# Altium schematic sheet AVCF-Schematics.SchDoc
size B; SheetNumber: 1; SheetTotal: 1
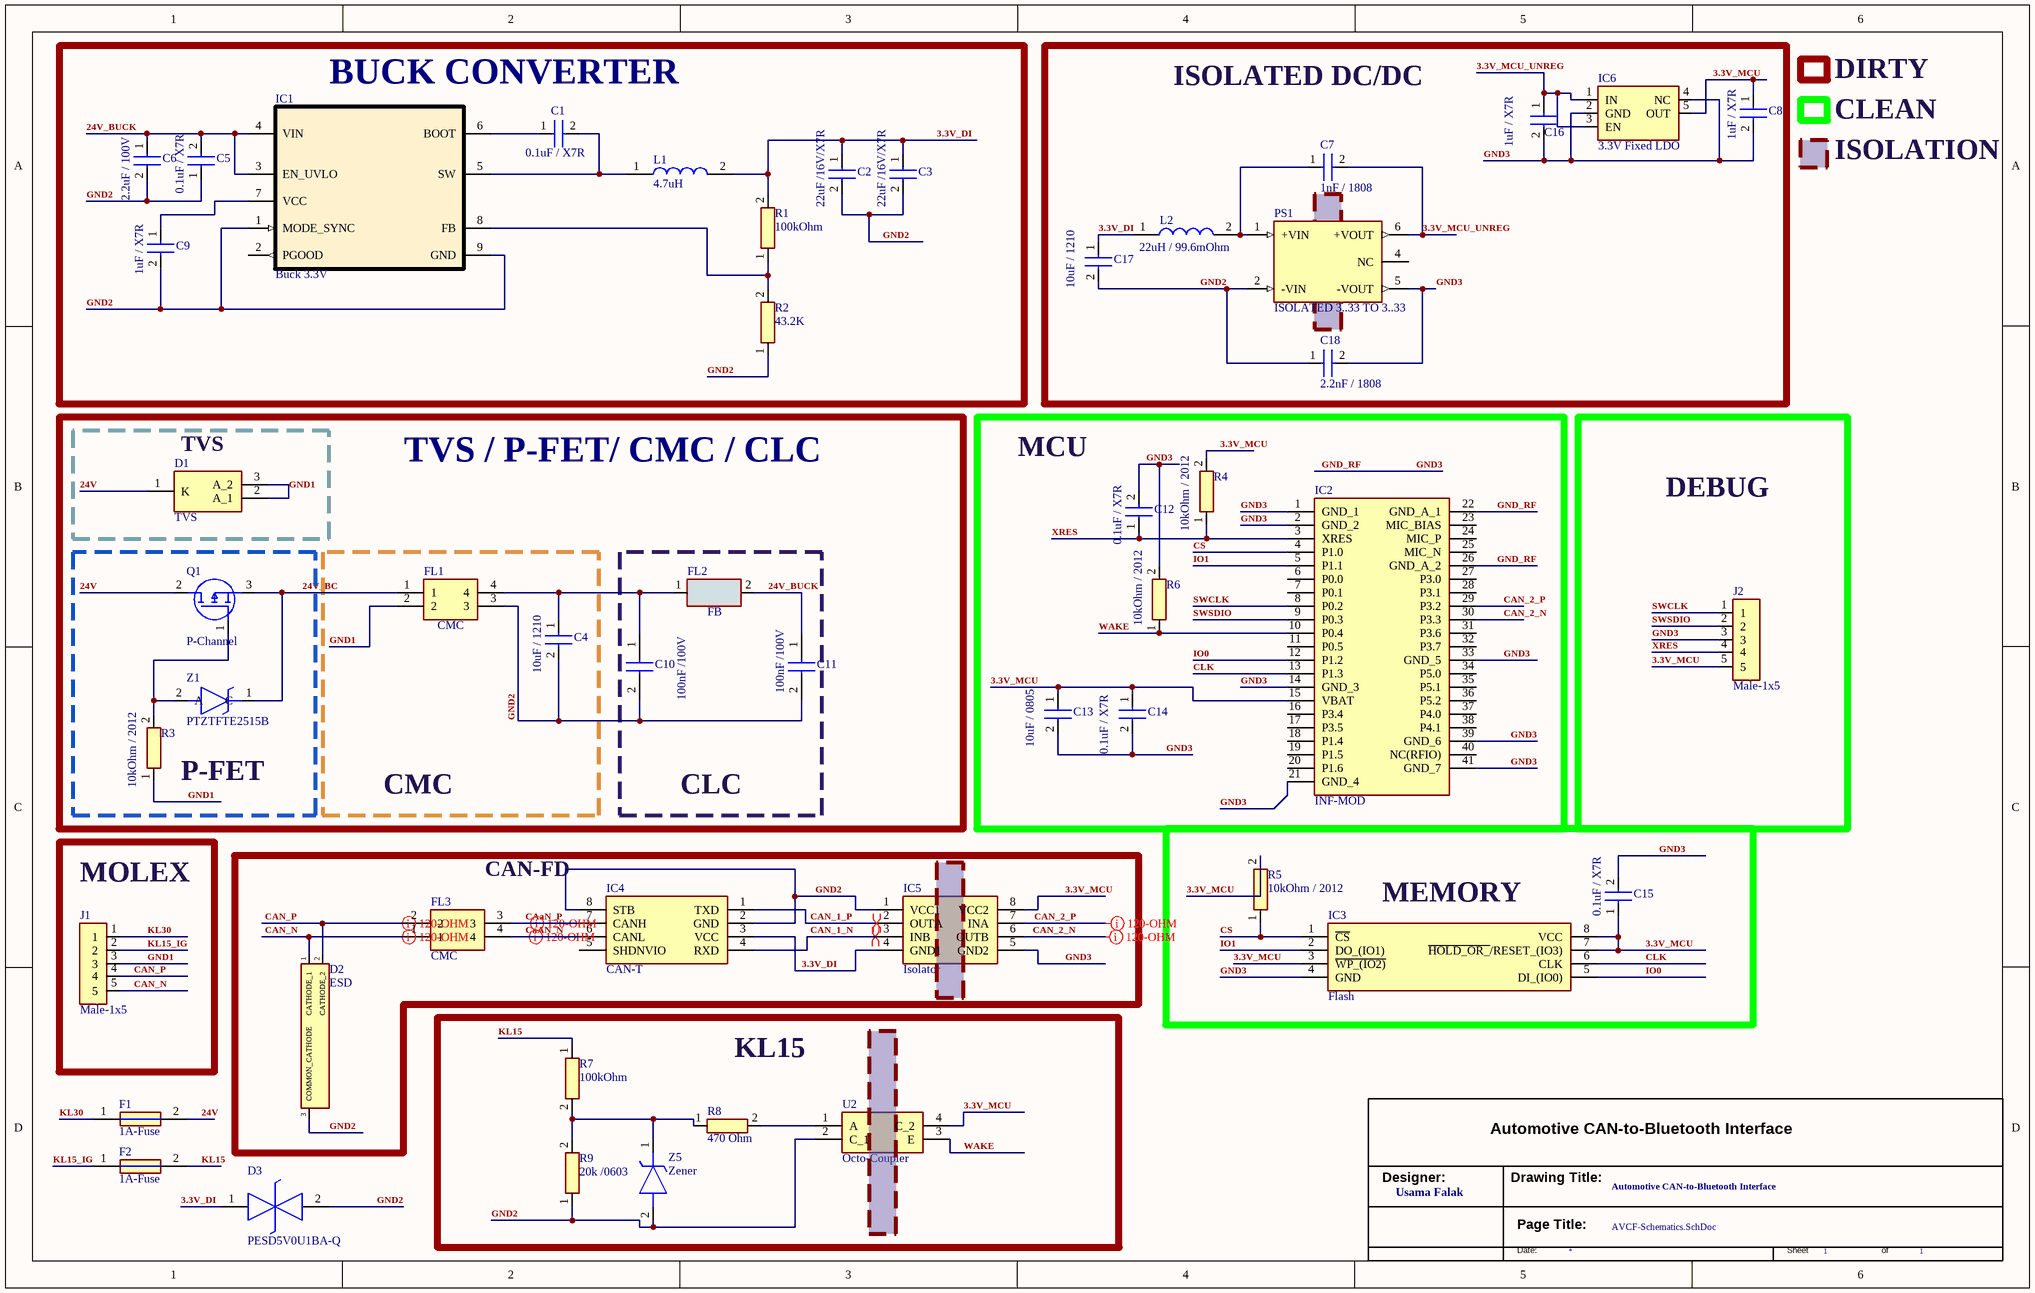
[diagram p0: AVCF-Schematics.SchDoc]

## Parts
*  TitleBlock_MCPG  (value not drawn)  (graphical)
C1  0.1uF / X7R  [MAJx16]
C2  22uF /16V/X7R  [CAPC3225X280N]
C3  22uF /16V/X7R  [CAPC3225X280N]
C4  10uF / 1210  [CAPC3225X280N]
C5  0.1uF / X7R  [MAJx16]
C6  2.2uF / 100V  [CGA4J2NP01H223J125AA]
C7  1nF / 1808  [C1808]
C8  1uF / X7R  [CAPC1608X100N]
C9  1uF / X7R  [CAPC1608X100N]
C10  100nF /100V  [CAPC1608X87N]
C11  100nF /100V  [CAPC1608X87N]
C12  0.1uF / X7R  [MAJx16]
C13  10uF / 0805  [CGA4J2NP01H223J125AA]
C14  0.1uF / X7R  [MAJx16]
C15  0.1uF / X7R  [MAJx16]
C16  1uF / X7R  [CAPC1608X100N]
C17  10uF / 1210  [CAPC3225X280N]
C18  2.2nF / 1808  [C1808]
D1  TVS  [SLD8S36A]
D2  ESD  [SOT95P230X110-3N]
D3  PESD5V0U1BA‑Q  [PESD5V0U1BA115]
F1  1A-Fuse  [FUSC6127X294N]
F2  1A-Fuse  [FUSC6127X294N]
FL1  CMC  [ACT45B1012PTL003]
FL2  FB  [BLM31KN102BH1L]
FL3  CMC  [ACT45B1012PTL003]
IC1  Buck 3.3V  [RPE0009A]
IC2  INF-MOD  [CYW20829B0P4TAI100XUMA1]
IC3  Flash  [SOIC127P790X216-8N]
IC4  CAN-T  [SOIC127P600X175-8N]
IC5  Isolator  [SOIC127P600X175-8N]
IC6  3.3V Fixed LDO  [SOT95P280X145-5N]
J1  Male-1x5  [43650-05(12,13,14)]
J2  Male-1x5  [43650-05(12,13,14)]
L1  4.7uH  [MSS6132T472MLC]
L2  22uH / 99.6mOhm  [XAL5030]
PS1  ISOLATED 3..33 TO 3..33  [CONV_RB-3.33.3S]
Q1  P-Channel  [FQD20N06TM]
R1  100kOhm  [RCS0805_E3]
R2  43.2K  [ERJP03_PA3_(0603)]
R3  10kOhm / 2012  [RESC2012X60N]
R4  10kOhm / 2012  [RESC2012X60N]
R5  10kOhm / 2012  [RESC2012X60N]
R6  10kOhm / 2012  [RESC2012X60N]
R7  100kOhm  [RCS0805_E3]
R8  470 Ohm  [RESC2012X50N]
R9  20k /0603  [RESC1608X55N]
U2  Octo-Coupler  [SOP254P695X242-4N]
Z1  PTZTFTE2515B  [PTZTFTE2515B]
Z5  Zener  [SOD3716X145N]

## Blocks framed on the sheet
BUCK CONVERTER: C1-C3 C5 C6 C9 IC1 L1 R1 R2
ISOLATED DC/DC: C7 C8 C16-C18 IC6 L2 PS1
TVS: D1
MCU: C12-C14 IC2 R4 R6
DEBUG: J2
P-FET: Q1 R3 Z1
CMC: C4 FL1
CLC: C10 C11 FL2
MOLEX: J1
CAN-FD: D2 FL3 IC4 IC5
MEMORY: C15 IC3 R5
KL15: R7-R9 U2 Z5

## Nets
3.3V_DI: C2.1 C3.1 C17.1 D3.1(K1) IC4.3(VCC) IC5.4(GND1) L1.2 L2.1 R1.2
3.3V_MCU: C8.1 C13.1 C14.1 C15.1 IC2.15(VBAT) IC3.3(~{WP_(IO2)}) IC3.7(~{HOLD_OR_}/RESET_(IO3)) IC3.8(VCC) IC5.8(VCC2) IC6.5(OUT) J2.5 R4.2 R5.2 U2.4(C_2)
3.3V_MCU_UNREG: C7.2 C16.1 IC6.1(IN) IC6.3(EN) PS1.6(+VOUT)
24V: D1.1(K) F1.2 Q1.2(D)
24V_BC: FL1.1 Q1.3(S) Z1.1(C)
24V_BUCK: C5.2 C6.1 C11.1 FL2.2 IC1.3(EN_UVLO) IC1.4(VIN)
CaAN_N: FL3.4 IC4.6(CANL)
CAaN_P: FL3.3 IC4.7(CANH)
CAN_1_N: IC4.4(RXD) IC5.3(INB)
CAN_1_P: IC4.1(TXD) IC5.2(OUTA)
CAN_2_N: IC2.30(P3.3) IC5.6(OUTB)
CAN_2_P: IC2.29(P3.2) IC5.7(INA)
CAN_N: D2.1(CATHODE_1) FL3.1 J1.5
CAN_P: D2.2(CATHODE_2) FL3.2 J1.4
CLK: IC2.13(P1.3) IC3.6(CLK)
CS: IC2.4(P1.0) IC3.1(~{CS}) R5.1
GND1: D1.2(A_1) D1.3(A_2) FL1.2 J1.3 R3.1
GND2: C2.2 C3.2 C4.2 C5.1 C6.2 C9.2 C10.2 C11.2 C17.2 C18.1 D2.3(COMMON_CATHODE) D3.2(K2) FL1.3 IC1.1(MODE_SYNC) IC1.9(GND) IC4.2(GND) IC4.8(STB) IC5.1(VCC1) PS1.2(-VIN) R2.1 R9.1 U2.2(C_1) Z5.2(A)
GND3: C8.2 C12.2 C13.2 C14.2 C15.2 C16.2 C18.2 IC2.1(GND_1) IC2.2(GND_2) IC2.14(GND_3) IC2.21(GND_4) IC2.22(GND_A_1) IC2.26(GND_A_2) IC2.33(GND_5) IC2.39(GND_6) IC2.41(GND_7) IC3.4(GND) IC5.5(GND2) IC6.2(GND) IC6.4(NC) J2.3 PS1.5(-VOUT) R6.2  [also labelled GND_RF]
IO0: IC2.12(P1.2) IC3.5(DI_(IO0))
IO1: IC2.5(P1.1) IC3.2(DO_(IO1))
KL15: F2.2 R7.1
KL15_IG: F2.1 J1.2
KL30: F1.1 J1.1
SWCLK: IC2.8(P0.2) J2.1
SWSDIO: IC2.9(P0.3) J2.2
WAKE: IC2.10(P0.4) R6.1 U2.3(E)
XRES: C12.1 IC2.3(XRES) J2.4 R4.1
NetC1_1: C1.1 IC1.6(BOOT)
NetC1_2: C1.2 IC1.5(SW) L1.1
NetC4_1: C4.1 C10.1 FL1.4 FL2.1
NetC7_1: C7.1 L2.2 PS1.1(+VIN)
NetC9_1: C9.1 IC1.7(VCC)
NetIC1_8: IC1.8(FB) R1.1 R2.2
NetQ1_1: Q1.1(G) R3.2 Z1.2(A)
NetR7_2: R7.2 R8.1 R9.2 Z5.1(K)
NetR8_2: R8.2 U2.1(A)

Not connected (* = marked no-connect by the designer): IC1 2(PGOOD); IC2 6(P0.0) 7(P0.1) 11(P0.5) 16(P3.4) 17(P3.5) 18(P1.4) 19(P1.5) 20(P1.6) 23(MIC_BIAS) 24(MIC_P) 25(MIC_N) 27(P3.0) 28(P3.1) 31(P3.6) 32(P3.7) 34(P5.0) 35(P5.1) 36(P5.2) 37(P4.0) 38(P4.1) 40(NC(RFIO)); IC4 5(SHDNVIO); PS1 4(NC)

## Layout directives
differential pair; differential pair class 120-OHM: CaAN_N, CAaN_P, CAN_2_N, CAN_2_P, CAN_N, CAN_P
differential pair: CAN_1_N, CAN_1_P

## Notes on the sheet
- DIRTY
- ISOLATION
- CLEAN
- TVS / P-FET/ CMC / CLC
- (in symbol TitleBlock_MCPG) Automotive CAN-to-Bluetooth Interface; Designer:; Drawing Title:; Usama Falak; Page Title:; Date:; Sheet; of

## Library data of the parts
C1 C5 C12 C14 C15 = MAJCU168BB7104KTEA01: Capacitor; Manufacturer_Name: TAIYO YUDEN; Datasheet Link: https://ds.yuden.co.jp/TYCOMPAS/or/detail?pn=MAJCU168BB7104KTEA01; Height: 0.8mm; Manufacturer_Part_Number: MAJCU168BB7104KTEA01
C2 C3 = CGA6P1X7R1C226M250AC: Capacitor; Manufacturer_Name: TDK; Datasheet Link: https://product.tdk.com/system/files/dam/doc/product/capacitor/ceramic/mlcc/catalog/mlcc_automotive_general_en.pdf; Height: 2.8mm; Manufacturer_Part_Number: CGA6P1X7R1C226M250AC; Mouser Part Number: 810-CGA6P1X7R1C226M; Mouser Price/Stock: https://www.mouser.co.uk/ProductDetail/TDK/CGA6P1X7R1C226M250AC?qs=NRhsANhppD%2FAe7owpb9Z2A%3D%3D; Arrow Part Number: CGA6P1X7R1C226M250AC; Arrow Price/Stock: https://www.arrow.com/en/products/cga6p1x7r1c226m250ac/tdk
C4 C17 = CGA6P1X7R2A106K250AC: Capacitor; Manufacturer_Name: TDK; Datasheet Link: https://product.tdk.com/info/en/catalog/datasheets/mlcc_automotive_general_en.pdf; Height: 2.8mm; Manufacturer_Part_Number: CGA6P1X7R2A106K250AC
C6 = CGA4J1X7R2A225K125AC: Capacitor; Manufacturer_Name: TDK; Datasheet Link: http://docs-europe.electrocomponents.com/webdocs/14e9/0900766b814e9125.pdf; Height: 1.45mm; Manufacturer_Part_Number: CGA4J1X7R2A225K125AC; Mouser Part Number: 810-CGA4J7R2A225K125; Mouser Price/Stock: https://www.mouser.co.uk/ProductDetail/TDK/CGA4J1X7R2A225K125AC?qs=17ckDYBRdekdsr2vV7W%252BtA%3D%3D
C7 = C1808C102JBGACAUTO: Capacitor; Manufacturer_Name: KEMET; Datasheet Link: https://content.kemet.com/datasheets/KEM_C1080_C0G_HV_AUTO_SMD.pdf; Height: 1.75mm; Manufacturer_Part_Number: C1808C102JBGACAUTO; Mouser Part Number: 80-C1808C102JBGAUTO; Mouser Price/Stock: https://www.mouser.co.uk/ProductDetail/KEMET/C1808C102JBGACAUTO?qs=sSYV1F9c5cEfVYDxFN%252BrgQ%3D%3D
C8 C9 C16 = CL10B105KB9VPNC: Capacitor; Manufacturer_Name: SAMSUNG; Datasheet Link: https://www.mouser.com/datasheet/2/585/MLCC_Automotive-1837966.pdf; Height: 1mm; Manufacturer_Part_Number: CL10B105KB9VPNC; Mouser Part Number: 187-CL10B105KB9VPNC; Mouser Price/Stock: https://www.mouser.co.uk/ProductDetail/Samsung-Electro-Mechanics/CL10B105KB9VPNC?qs=3Rah4i%252BhyCFE9VrNkitckQ%3D%3D
C10 C11 = C0603C104J1RACAUTO7411: Multilayer Ceramic Capacitors MLCC - SMD/SMT 100V 100000pF 5% X7R 1608 AEC-Q200; Manufacturer_Name: KEMET; Datasheet Link: https://cz.mouser.com/datasheet/2/447/KEM_C1023_X7R_AUTO_SMD-3316698.pdf; Height: 0.87mm; Manufacturer_Part_Number: C0603C104J1RACAUTO7411; Mouser Part Number: 80-C0603C104J1RAUTO7; Mouser Price/Stock: https://www.mouser.co.uk/ProductDetail/KEMET/C0603C104J1RACAUTO7411?qs=ulEaXIWI0c%252BJFv1YOR%252BSZg%3D%3D
C13 = CGA4J1X7S1C106M125AE: Capacitor; Manufacturer_Name: TDK; Datasheet Link: http://docs-europe.electrocomponents.com/webdocs/14e9/0900766b814e9125.pdf; Height: 1.45mm; Manufacturer_Part_Number: CGA4J1X7S1C106M125AE; Mouser Part Number: 810-CGA4J1X7S1C106MA; Mouser Price/Stock: https://www.mouser.co.uk/ProductDetail/TDK/CGA4J1X7S1C106M125AE?qs=nQSIdc08i%252BcCPp0JpxJc5Q%3D%3D; Arrow Part Number: CGA4J1X7S1C106M125AE; Arrow Price/Stock: https://www.arrow.com/en/products/cga4j1x7s1c106m125ae/tdk?utm_currency=USD&region=nac
C18 = C1808C222FDGACAUTO: Capacitor; Manufacturer_Name: KEMET; Height: 1.75mm; Manufacturer_Part_Number: C1808C222FDGACAUTO
D1 = SLD8S36A: TVS Diode (Uni-directional); Manufacturer_Name: LITTELFUSE; Datasheet Link: https://datasheet.datasheetarchive.com/originals/distributors/DKDS41/DSANUWW0026090.pdf; Height: 4.78mm; Manufacturer_Part_Number: SLD8S36A; Mouser Part Number: 576-SLD8S36A; Mouser Price/Stock: https://www.mouser.co.uk/ProductDetail/Littelfuse/SLD8S36A?qs=CoLE6mUHV0srESI5Dw%2FcKA%3D%3D; Arrow Part Number: SLD8S36A; Arrow Price/Stock: https://www.arrow.com/en/products/sld8s36a/littelfuse?region=nac
D2 = PESD2CAN,215: Diode ESD (Bi-directional); Manufacturer_Name: Nexperia; Datasheet Link: https://assets.nexperia.com/documents/data-sheet/PESD2CAN.pdf; Height: 1.1mm; Manufacturer_Part_Number: PESD2CAN,215; Mouser Part Number: 771-PESD2CAN-T/R; Mouser Price/Stock: https://www.mouser.co.uk/ProductDetail/Nexperia/PESD2CAN215?qs=LOCUfHb8d9sqg7TaLUP2JQ%3D%3D; Arrow Part Number: PESD2CAN,215; Arrow Price/Stock: https://www.arrow.com/en/products/pesd2can215/nexperia?utm_currency=USD&region=nac
D3 = PESD5V0U1BA: Diode ESD (Bi-directional); Manufacturer_Name: Nexperia; Manufacturer_Part_Number: PESD5V0U1BA-Q; Mouser Part Number: 771-PESD5V0U1BA115; Mouser Price/Stock: https://www.mouser.co.uk/ProductDetail/Nexperia/PESD5V0U1BA115?qs=LOCUfHb8d9tqw6h%2FD3HZHw%3D%3D; Arrow Part Number: PESD5V0U1BA,115; Arrow Price/Stock: https://www.arrow.com/en/products/pesd5v0u1ba115/nexperia?region=nac
F1 F2 = 0451001.MRSN: Fuse; Manufacturer_Name: LITTELFUSE; Datasheet Link: http://www.littelfuse.com/~/media/electronics/datasheets/fuses/littelfuse_fuse_451_453_datasheet.pdf.pdf; Height: 2.94mm; Manufacturer_Part_Number: 0451001.MRSN; Mouser Part Number: 576-0451001.MRSN; Mouser Price/Stock: https://www.mouser.co.uk/ProductDetail/Littelfuse/0451001.MRSN?qs=sngaqPsMX3Jy67sY6Qv%252Bgw%3D%3D; Arrow Part Number: 0451001.MRSN; Arrow Price/Stock: https://www.arrow.com/en/products/0451001.mrsn/littelfuse?region=nac
FL1 FL3 = ACT45B-510-2P-TL003: Filter; Manufacturer_Name: TDK; Datasheet Link: https://product.tdk.com/system/files/dam/doc/product/emc/emc/cmf_cmc/catalog/cmf_automotive_signal_act45b_en.pdf; Height: 3mm; Manufacturer_Part_Number: ACT45B-510-2P-TL003; Mouser Part Number: 810-ACT45B5102PTL003; Mouser Price/Stock: https://www.mouser.co.uk/ProductDetail/TDK/ACT45B-510-2P-TL003?qs=U1cgCdF9Le9LCroNYLqljw%3D%3D; Arrow Part Number: ACT45B-510-2P-TL003; Arrow Price/Stock: https://www.arrow.com/en/products/act45b-510-2p-tl003/tdk?utm_currency=USD&region=nac
FL2 = BLM31KN601SZ1L: Filter; Manufacturer_Name: Murata Electronics; Datasheet Link: https://www.murata.com/en-us/products/productdetail?partno=BLM31KN601SZ1%23; Height: 1.8mm; Manufacturer_Part_Number: BLM31KN601SZ1L; Mouser Part Number: 81-BLM31KN601SZ1L; Mouser Price/Stock: https://www.mouser.co.uk/ProductDetail/Murata-Electronics/BLM31KN601SZ1L?qs=EU6FO9ffTwfBlPk3K10OmA%3D%3D; Arrow Part Number: BLM31KN601SZ1L; Arrow Price/Stock: https://www.arrow.com/en/products/blm31kn601sz1l/murata-manufacturing?region=nac
IC1 = LMR36506MSC3RPERQ1: 3-V to 65-V, 0.6-A buck converter optimized for size and light load efficiency 9-VQFN-HR -40 to 150; Manufacturer_Name: Texas Instruments; TYPE: TYPE; RefDes: RefDes; Copyright: Copyright (C) 2025 Ultra Librarian. All rights reserved.; Manufacturer_Part_Number: LMR36506MSC3RPERQ1
IC2 = CYW20829B0P4TAI100XUMA1: Integrated Circuit; Manufacturer_Name: Infineon; Datasheet Link: https://www.infineon.com/dgdl/Infineon-CYW20829B0-P4TAI100_CYW20829B0-P4EPI100_AIROC_Bluetooth_LE_module-DataSheet-v01_00-EN.pdf?fileId=8ac78c8c8d2fe47b018d5df5d7d635e4; Height: 1.95mm; Manufacturer_Part_Number: CYW20829B0P4TAI100XUMA1; Mouser Part Number: 726-CYW20829B0P4TAI1; Mouser Price/Stock: https://www.mouser.co.uk/ProductDetail/Infineon-Technologies/CYW20829B0P4TAI100XUMA1?qs=ZcfC38r4PotHfjmclNTDeQ%3D%3D; Arrow Part Number: CYW20829B0P4TAI100XUMA1; Arrow Price/Stock: null?region=nac
IC3 = W25Q128JVSIM: Integrated Circuit; Manufacturer_Name: Winbond; Datasheet Link: https://www.winbond.com/hq/search-resource-file.jsp?partNo=W25Q128JVSIM&type=datasheet; Height: 2.16mm; Manufacturer_Part_Number: W25Q128JVSIM; Mouser Part Number: 454-W25Q128JVSIM; Mouser Price/Stock: https://www.mouser.co.uk/ProductDetail/Winbond/W25Q128JVSIM?qs=qSfuJ%252Bfl%2Fd6d7A5WLggp6w%3D%3D; Arrow Part Number: W25Q128JVSIM; Arrow Price/Stock: https://www.arrow.com/en/products/w25q128jvsim/winbond-electronics?utm_currency=USD&region=nac
IC4 = TCAN3403DRQ1: Integrated Circuit; Manufacturer_Name: Texas Instruments; Datasheet Link: https://www.ti.com/lit/ds/symlink/tcan3403-q1.pdf?ts=1732780388772&ref_url=https%253A%252F%252Fwww.ti.com%252Fproduct%252FTCAN3403-Q1%252Fpart-details%252FTCAN3403DRQ1; Height: 1.75mm; Manufacturer_Part_Number: TCAN3403DRQ1; Mouser Part Number: 595-TCAN3403DRQ1; Mouser Price/Stock: https://www.mouser.co.uk/ProductDetail/Texas-Instruments/TCAN3403DRQ1?qs=VVKQmw408U8i3BeOClYB9g%3D%3D; Arrow Part Number: TCAN3403DRQ1; Arrow Price/Stock: https://www.arrow.com/en/products/tcan3403drq1/texas-instruments?utm_currency=USD&region=nac
IC5 = ISO7721D: Integrated Circuit; Manufacturer_Name: Texas Instruments; Datasheet Link: https://datasheet.datasheetarchive.com/originals/distributors/DKDS41/DSANUWW0029365.pdf; Height: 1.75mm; Manufacturer_Part_Number: ISO7721D; Mouser Part Number: 595-ISO7721D; Mouser Price/Stock: https://www.mouser.co.uk/ProductDetail/Texas-Instruments/ISO7721D?qs=0C8XhJW8e4rJ9x%252B8j%252BVmOg%3D%3D; Arrow Part Number: ISO7721D; Arrow Price/Stock: https://www.arrow.com/en/products/iso7721d/texas-instruments?utm_currency=USD&region=nac
IC6 = TLV70233PDBVT: Linear Voltage Regulator IC Positive Fixed 1 Output 300mA SOT-23-5; Manufacturer_Name: Texas Instruments; Datasheet Link: http://www.ti.com/lit/gpn/TLV702P; Height: 1.45mm; Manufacturer_Part_Number: TLV70233PDBVT; Mouser Part Number: 595-TLV70233PDBVT; Mouser Price/Stock: https://www.mouser.co.uk/ProductDetail/Texas-Instruments/TLV70233PDBVT?qs=wrT8kFYR77%252BTqHlKX%252BuSfQ%3D%3D; Arrow Part Number: TLV70233PDBVT; Arrow Price/Stock: https://www.arrow.com/en/products/tlv70233pdbvt/texas-instruments?region=nac
J1 J2 = 43650-0513: Connector; Manufacturer_Name: Molex; Datasheet Link: https://www.molex.com/pdm_docs/sd/436500212_sd.pdf; Height: 5.57mm; Manufacturer_Part_Number: 43650-0513; Mouser Part Number: 538-43650-0513; Mouser Price/Stock: https://www.mouser.co.uk/ProductDetail/Molex/43650-0513?qs=pfd5qewlna64FC5JJX8ojQ%3D%3D
L1 = MSS6132T-472MLC: Inductor; Manufacturer_Name: COILCRAFT; Datasheet Link: https://www.coilcraft.com/getmedia/d035c9b3-191d-46aa-ab3f-5c1a849157c1/mss6132t.pdf; Height: 3.2mm; Manufacturer_Part_Number: MSS6132T-472MLC; Mouser Part Number: 994-MSS6132T-472MLC; Mouser Price/Stock: https://www.mouser.co.uk/ProductDetail/Coilcraft/MSS6132T-472MLC?qs=qSfuJ%252Bfl%2Fd7aN6NNAoi%252BZw%3D%3D
L2 = XAL5050-223MEC: Inductor; Manufacturer_Name: COILCRAFT; Datasheet Link: https://www.coilcraft.com/getmedia/49bc46c8-4b2c-45b9-9b6c-2eaa235ea698/xal50xx.pdf; Manufacturer_Part_Number: XAL5050-223MEC; Mouser Part Number: 994-XAL5050-223MEC; Mouser Price/Stock: https://www.mouser.co.uk/ProductDetail/Coilcraft/XAL5050-223MEC?qs=zCSbvcPd3pZDBbGj4RTtgg%3D%3D
PS1 = RB-3.33.3S: 1W DC/DC-Converter 'ECONOLINE' SIP7 1kV unreg; MF: Recom Power; SnapEDA_Link: https://www.snapeda.com/parts/RB-3.33.3S/Recom+Power/view-part/?ref=snap; Package: SIP-7 Recom Power; Value: *; MP: RB-3.33.3S; Check_prices: https://www.snapeda.com/parts/RB-3.33.3S/Recom+Power/view-part/?ref=eda
Q1 = FQD8P10TM-F085: MOSFET (P-Channel); Manufacturer_Name: onsemi; Datasheet Link: https://www.onsemi.com/pub/Collateral/FQD8P10TM_F085-D.PDF; Height: 2.399mm; Manufacturer_Part_Number: FQD8P10TM-F085; Mouser Part Number: 512-FQD8P10TM_F085; Mouser Price/Stock: https://www.mouser.co.uk/ProductDetail/onsemi-Fairchild/FQD8P10TM-F085?qs=0lQeLiL1qyakMKmcxY59wg%3D%3D; Arrow Part Number: FQD8P10TM-F085; Arrow Price/Stock: https://www.arrow.com/en/products/fqd8p10tm-f085/on-semiconductor?utm_currency=USD&region=nac
R1 R7 = RCS0805100KFKEA: Resistor; Manufacturer_Name: Vishay; Datasheet Link: https://www.vishay.com/docs/20065/rcse3.pdf; Manufacturer_Part_Number: RCS0805100KFKEA; Mouser Part Number: 71-RCS0805100KFKEA; Mouser Price/Stock: https://www.mouser.co.uk/ProductDetail/Vishay-Dale/RCS0805100KFKEA?qs=NKmfXavxMay%252BH0mbX9hKBw%3D%3D; Arrow Part Number: RCS0805100KFKEA; Arrow Price/Stock: https://www.arrow.com/en/products/rcs0805100kfkea/vishay?region=nac
R2 = ERJ-PA3D4322V: Resistor; Manufacturer_Name: Panasonic; Datasheet Link: https://industrial.panasonic.com/cdbs/www-data/pdf/RDO0000/AOA0000C331.pdf; Height: 0.55mm; Manufacturer_Part_Number: ERJ-PA3D4322V; Mouser Part Number: 667-ERJ-PA3D4322V; Mouser Price/Stock: https://www.mouser.com/Search/Refine.aspx?Keyword=667-ERJ-PA3D4322V
R3-R6 = RT0805FRE1010KL: Resistor; Manufacturer_Name: YAGEO; Datasheet Link: https://www.mouser.com/datasheet/2/447/PYu_RT_1_to_0_01_RoHS_L_12-3003070.pdf; Height: 0.6mm; Manufacturer_Part_Number: RT0805FRE1010KL; Mouser Part Number: 603-RT0805FRE1010KL; Mouser Price/Stock: https://www.mouser.co.uk/ProductDetail/YAGEO/RT0805FRE1010KL?qs=F5EMLAvA7IDXJrrkpAsXTw%3D%3D
R8 = RCS0805470RJNEA: Resistor; Manufacturer_Name: Vishay; Datasheet Link: https://componentsearchengine.com/Datasheets/1/RCS0805470RJNEA.pdf; Height: 0.5mm; Manufacturer_Part_Number: RCS0805470RJNEA; Mouser Part Number: 71-RCS0805470RJNEA; Mouser Price/Stock: https://www.mouser.co.uk/ProductDetail/Vishay-Dale/RCS0805470RJNEA?qs=NKmfXavxMawp2y0h5Y47sg%3D%3D
R9 = CRCW060320K0FKEAHP: Resistor; Manufacturer_Name: Vishay; Datasheet Link: http://www.vishay.com/docs/20043/crcwhpe3.pdf; Height: 0.55mm; Manufacturer_Part_Number: CRCW060320K0FKEAHP; Mouser Part Number: 71-CRCW060320K0FKEAH; Mouser Price/Stock: https://www.mouser.co.uk/ProductDetail/Vishay-Dale/CRCW060320K0FKEAHP?qs=k2%2FDWSARqgHwdUI5VivZZA%3D%3D; Arrow Part Number: CRCW060320K0FKEAHP; Arrow Price/Stock: https://www.arrow.com/en/products/crcw060320k0fkeahp/vishay?utm_currency=USD&region=nac
U2 = VOMA617A-3X001T: Undefined or Miscellaneous; Manufacturer_Name: Vishay; Datasheet Link: http://www.vishay.com/docs/84433/voma617a.pdf; Height: 2.42mm; Manufacturer_Part_Number: VOMA617A-3X001T; Mouser Part Number: 78-VOMA617A-3X001T; Mouser Price/Stock: https://www.mouser.co.uk/ProductDetail/Vishay-Semiconductors/VOMA617A-3X001T?qs=F5EMLAvA7IBCSKWS3y54oA%3D%3D; Arrow Part Number: VOMA617A-3X001T; Arrow Price/Stock: https://www.arrow.com/en/products/voma617a-3x001t/vishay?region=nac
Z1 = PTZTFTE2515B: Zener Diode; Manufacturer_Name: ROHM Semiconductor; Datasheet Link: https://fscdn.rohm.com/en/products/databook/datasheet/discrete/diode/zener/ptztfte2515b-e.pdf; Height: 2.2mm; Manufacturer_Part_Number: PTZTFTE2515B; Mouser Part Number: 755-PTZTFTE2515B; Mouser Price/Stock: https://www.mouser.co.uk/ProductDetail/ROHM-Semiconductor/PTZTFTE2515B?qs=4v%252BiZTmLVHGQdTFaf9B3oQ%3D%3D
Z5 = BZT52C5V1-7-F: Zener Diode; Manufacturer_Name: Diodes Incorporated; Datasheet Link: https://www.diodes.com//assets/Datasheets/ds18004.pdf; Height: 1.45mm; Manufacturer_Part_Number: BZT52C5V1-7-F; Mouser Part Number: 621-BZT52C5V1-F; Mouser Price/Stock: https://www.mouser.co.uk/ProductDetail/Diodes-Incorporated/BZT52C5V1-7-F?qs=FFy5bLXC7EennpZVc1%2Fcow%3D%3D; Arrow Part Number: BZT52C5V1-7-F; Arrow Price/Stock: https://www.arrow.com/en/products/bzt52c5v1-7-f/diodes-incorporated?utm_currency=USD&region=nac
* = TitleBlock_MCPG: Page Create Date: March  8, 1995